# Altium schematic sheet powerstrip2.SchDoc
size A
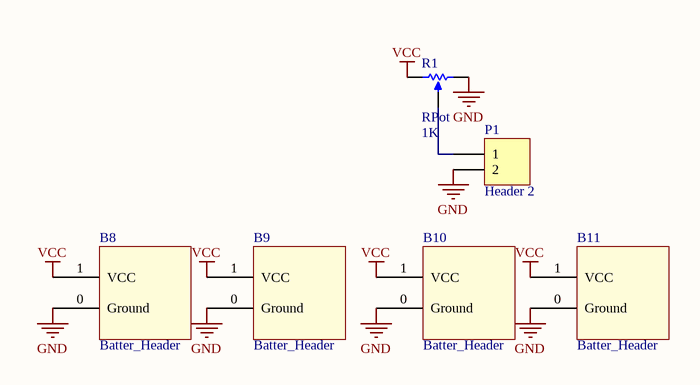
[diagram p0: powerstrip2.SchDoc]

## Parts
B8  Batter_Header  [Battery_Header]
B9  Batter_Header  [Battery_Header]
B10  Batter_Header  [Battery_Header]
B11  Batter_Header  [Battery_Header]
P1  Header 2  [HDR1X2]
R1  RPot  value 1K  [VR5]

## Nets
GND: B8.0(Ground) B9.0(Ground) B10.0(Ground) B11.0(Ground) P1.2 R1.2(BOT)
VCC: B8.1(VCC) B9.1(VCC) B10.1(VCC) B11.1(VCC) R1.1(TOP)
NetP1_1: P1.1 R1.3(TAP)

## Library data of the parts
P1 = Header 2: Header, 2-Pin; LatestRevisionDate: 17-Jul-2002; LatestRevisionNote: Re-released for DXP Platform.; Publisher: Altium Limited
R1 = RPot: Potentiometer; pin to pad: 2>3 3>2; Sim Note: Enter the Resistance value and the set point into parameter fields.; Set Position: 0.5; Published: 8-Jun-2000; LatestRevisionDate: 17-Jul-2002; LatestRevisionNote: Re-released for DXP Platform.; PackageReference: VR5; Publisher: Altium Limited